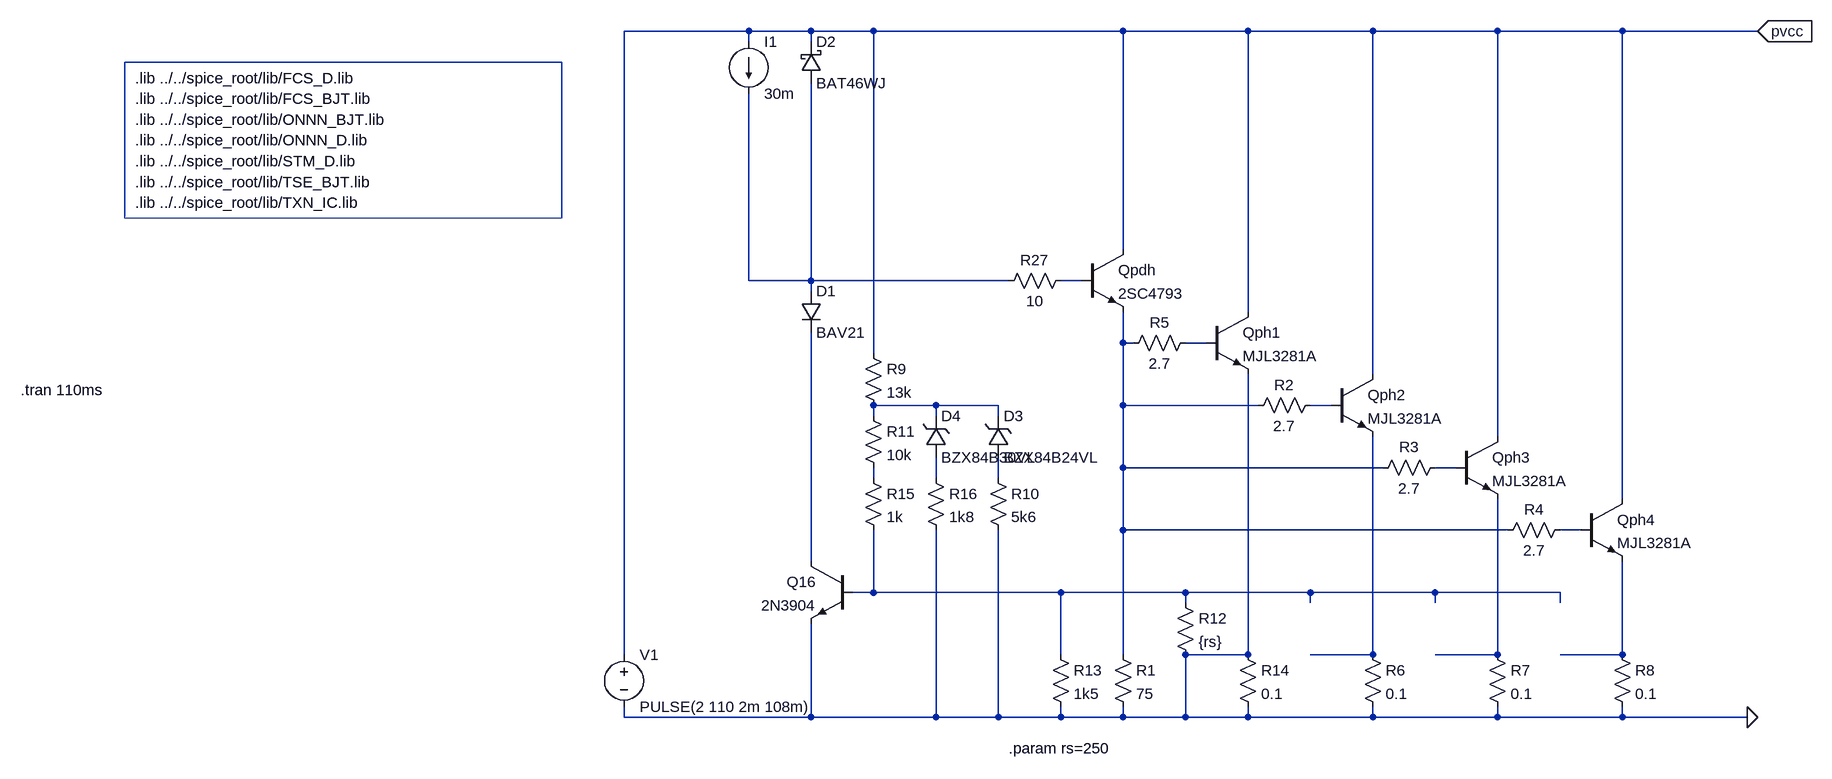
[diagram p0: schematic pab3bbb-arguo-prot-1slope.asc]
pab3bbb-arguo-prot-1slope.asc, the LTspice schematic file:
Version 4
SHEET 1 6124 2336
WIRE 1056 -1280 864 -1280
WIRE 1152 -1280 1056 -1280
WIRE 1248 -1280 1152 -1280
WIRE 1632 -1280 1248 -1280
WIRE 1824 -1280 1632 -1280
WIRE 2016 -1280 1824 -1280
WIRE 2208 -1280 2016 -1280
WIRE 2400 -1280 2208 -1280
WIRE 2608 -1280 2400 -1280
WIRE 1056 -1264 1056 -1280
WIRE 1152 -1264 1152 -1280
WIRE 1632 -944 1632 -1280
WIRE 1056 -896 1056 -1184
WIRE 1152 -896 1152 -1200
WIRE 1152 -896 1056 -896
WIRE 1456 -896 1152 -896
WIRE 1568 -896 1536 -896
WIRE 1152 -880 1152 -896
WIRE 1824 -848 1824 -1280
WIRE 1632 -800 1632 -848
WIRE 1648 -800 1632 -800
WIRE 1760 -800 1728 -800
WIRE 1248 -784 1248 -1280
WIRE 2016 -752 2016 -1280
WIRE 1344 -704 1248 -704
WIRE 1440 -704 1344 -704
WIRE 1632 -704 1632 -800
WIRE 1840 -704 1632 -704
WIRE 1952 -704 1920 -704
WIRE 1248 -688 1248 -704
WIRE 1344 -688 1344 -704
WIRE 1440 -688 1440 -704
WIRE 2208 -656 2208 -1280
WIRE 1632 -608 1632 -704
WIRE 2032 -608 1632 -608
WIRE 2144 -608 2112 -608
WIRE 1248 -592 1248 -608
WIRE 1344 -592 1344 -624
WIRE 1440 -592 1440 -624
WIRE 2400 -560 2400 -1280
WIRE 1632 -512 1632 -608
WIRE 2224 -512 1632 -512
WIRE 2336 -512 2304 -512
WIRE 1152 -464 1152 -816
WIRE 1248 -416 1248 -512
WIRE 1248 -416 1216 -416
WIRE 1536 -416 1248 -416
WIRE 1728 -416 1536 -416
WIRE 1920 -416 1728 -416
WIRE 2112 -416 1920 -416
WIRE 2304 -416 2112 -416
WIRE 1728 -400 1728 -416
WIRE 1920 -400 1920 -416
WIRE 2112 -400 2112 -416
WIRE 2304 -400 2304 -416
WIRE 864 -320 864 -1280
WIRE 1536 -320 1536 -416
WIRE 1632 -320 1632 -512
WIRE 1824 -320 1824 -752
WIRE 1824 -320 1728 -320
WIRE 2016 -320 2016 -656
WIRE 2016 -320 1920 -320
WIRE 2208 -320 2208 -560
WIRE 2208 -320 2112 -320
WIRE 2400 -320 2400 -464
WIRE 2400 -320 2304 -320
WIRE 864 -224 864 -240
WIRE 1152 -224 1152 -368
WIRE 1152 -224 864 -224
WIRE 1344 -224 1344 -512
WIRE 1344 -224 1152 -224
WIRE 1440 -224 1440 -512
WIRE 1440 -224 1344 -224
WIRE 1536 -224 1536 -240
WIRE 1536 -224 1440 -224
WIRE 1632 -224 1632 -240
WIRE 1632 -224 1536 -224
WIRE 1728 -224 1728 -320
WIRE 1728 -224 1632 -224
WIRE 1824 -224 1824 -240
WIRE 1824 -224 1728 -224
WIRE 2016 -224 2016 -240
WIRE 2016 -224 1824 -224
WIRE 2208 -224 2208 -240
WIRE 2208 -224 2016 -224
WIRE 2400 -224 2400 -240
WIRE 2400 -224 2208 -224
WIRE 2592 -224 2400 -224
FLAG 2608 -1280 pvcc
IOPIN 2608 -1280 In
FLAG 2592 -224 0
SYMBOL res 1552 -912 R90
WINDOW 0 0 56 VBottom 2
WINDOW 3 32 56 VTop 2
SYMATTR InstName R27
SYMATTR Value 10
SYMBOL npn 1760 -848 R0
SYMATTR InstName Qph1
SYMATTR Value MJL3281A
SYMBOL res 1744 -816 R90
WINDOW 0 0 56 VBottom 2
WINDOW 3 32 56 VTop 2
SYMATTR InstName R5
SYMATTR Value 2.7
SYMBOL res 1808 -336 R0
SYMATTR InstName R14
SYMATTR Value 0.1
SYMBOL npn 1568 -944 R0
SYMATTR InstName Qpdh
SYMATTR Value 2SC4793
SYMBOL res 1616 -336 R0
SYMATTR InstName R1
SYMATTR Value 75
SYMBOL npn 1216 -464 M0
SYMATTR InstName Q16
SYMATTR Value 2N3904
SYMBOL schottky 1136 -1200 M180
WINDOW 0 24 64 Left 2
WINDOW 3 24 0 Left 2
SYMATTR InstName D2
SYMATTR Value BAT46WJ
SYMATTR Description Diode
SYMATTR Type diode
SYMBOL current 1056 -1264 R0
WINDOW 123 0 0 Left 0
WINDOW 39 0 0 Left 0
SYMATTR InstName I1
SYMATTR Value 30m
SYMBOL voltage 864 -336 R0
WINDOW 123 0 0 Left 0
WINDOW 39 0 0 Left 0
SYMATTR InstName V1
SYMATTR Value PULSE(2 110 2m 108m)
SYMBOL npn 1952 -752 R0
SYMATTR InstName Qph2
SYMATTR Value MJL3281A
SYMBOL res 1936 -720 R90
WINDOW 0 0 56 VBottom 2
WINDOW 3 32 56 VTop 2
SYMATTR InstName R2
SYMATTR Value 2.7
SYMBOL npn 2144 -656 R0
SYMATTR InstName Qph3
SYMATTR Value MJL3281A
SYMBOL res 2128 -624 R90
WINDOW 0 0 56 VBottom 2
WINDOW 3 32 56 VTop 2
SYMATTR InstName R3
SYMATTR Value 2.7
SYMBOL npn 2336 -560 R0
SYMATTR InstName Qph4
SYMATTR Value MJL3281A
SYMBOL res 2320 -528 R90
WINDOW 0 0 56 VBottom 2
WINDOW 3 32 56 VTop 2
SYMATTR InstName R4
SYMATTR Value 2.7
SYMBOL res 2000 -336 R0
SYMATTR InstName R6
SYMATTR Value 0.1
SYMBOL res 2192 -336 R0
SYMATTR InstName R7
SYMATTR Value 0.1
SYMBOL res 2384 -336 R0
SYMATTR InstName R8
SYMATTR Value 0.1
SYMBOL diode 1136 -880 R0
SYMATTR InstName D1
SYMATTR Value BAV21
SYMBOL res 1712 -416 R0
SYMATTR InstName R12
SYMATTR Value {rs}
SYMBOL res 1232 -800 R0
SYMATTR InstName R9
SYMATTR Value 13k
SYMBOL res 1232 -704 R0
SYMATTR InstName R11
SYMATTR Value 10k
SYMBOL zener 1424 -624 M180
WINDOW 0 24 64 Left 2
WINDOW 3 24 0 Left 2
SYMATTR InstName D3
SYMATTR Value BZX84B24VL
SYMATTR Description Diode
SYMATTR Type diode
SYMBOL res 1424 -608 R0
SYMATTR InstName R10
SYMATTR Value 5k6
SYMBOL res 1520 -336 R0
SYMATTR InstName R13
SYMATTR Value 1k5
SYMBOL res 1232 -608 R0
SYMATTR InstName R15
SYMATTR Value 1k
SYMBOL zener 1328 -624 M180
WINDOW 0 24 64 Left 2
WINDOW 3 24 0 Left 2
SYMATTR InstName D4
SYMATTR Value BZX84B30VL
SYMATTR Description Diode
SYMATTR Type diode
SYMBOL res 1328 -608 R0
SYMATTR InstName R16
SYMATTR Value 1k8
TEXT 112 -1144 Left 2 !.lib ../../spice_root/lib/ONNN_BJT.lib
TEXT 112 -1080 Left 2 !.lib ../../spice_root/lib/STM_D.lib
TEXT 112 -1176 Left 2 !.lib ../../spice_root/lib/FCS_BJT.lib
TEXT 112 -1208 Left 2 !.lib ../../spice_root/lib/FCS_D.lib
TEXT 112 -1112 Left 2 !.lib ../../spice_root/lib/ONNN_D.lib
TEXT 112 -1048 Left 2 !.lib ../../spice_root/lib/TSE_BJT.lib
TEXT 112 -1016 Left 2 !.lib ../../spice_root/lib/TXN_IC.lib
TEXT -64 -728 Left 2 !.tran 110ms
TEXT 1456 -176 Left 2 !.param rs=250
RECTANGLE Normal 768 -992 96 -1232

The netlist it stands for:
* pab3bbb-arguo-prot-1slope.asc
R27 N002 N001 10
Qph1 pvcc N004 0 0 MJL3281A
R5 N004 N003 2.7
R14 0 0 0.1
Qpdh pvcc N002 N003 0 2SC4793
R1 N003 0 75
Q16 N012 N013 0 0 2N3904
D2 N001 pvcc BAT46WJ
I1 pvcc N001 30m
V1 pvcc 0 PULSE(2 110 2m 108m)
Qph2 pvcc N006 N014 0 MJL3281A
R2 N006 N003 2.7
Qph3 pvcc N007 N015 0 MJL3281A
R3 N007 N003 2.7
Qph4 pvcc N011 N016 0 MJL3281A
R4 N011 N003 2.7
R6 N014 0 0.1
R7 N015 0 0.1
R8 N016 0 0.1
D1 N001 N012 BAV21
R12 N013 0 {rs}
R9 pvcc N005 13k
R11 N005 N008 10k
D3 N010 N005 BZX84B24VL
R10 N010 0 5k6
R13 N013 0 1k5
R15 N008 N013 1k
D4 N009 N005 BZX84B30VL
R16 N009 0 1k8
.model D D
.lib standard.dio
.model NPN NPN
.model PNP PNP
.lib standard.bjt
.lib ../../spice_root/lib/ONNN_BJT.lib
.lib ../../spice_root/lib/STM_D.lib
.lib ../../spice_root/lib/FCS_BJT.lib
.lib ../../spice_root/lib/FCS_D.lib
.lib ../../spice_root/lib/ONNN_D.lib
.lib ../../spice_root/lib/TSE_BJT.lib
.lib ../../spice_root/lib/TXN_IC.lib
.tran 110ms
.param rs=250
.backanno
.end